# EAGLE design solar-fan (EAGLE 7.4.0)
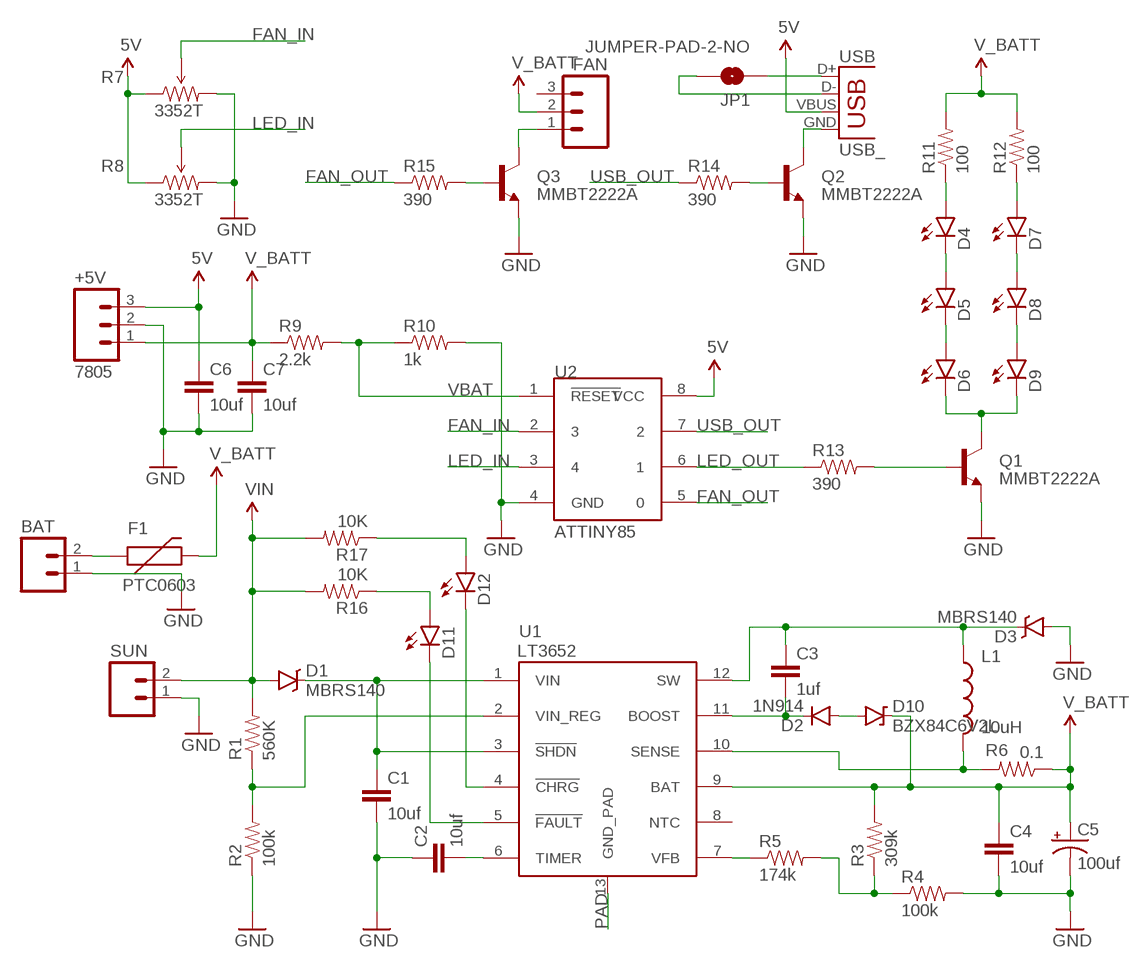
[diagram p0: schematic, sheet 1]

## Parts
+5V  7805  M03PTH  [1X03]
BAT  M025MM  [SCREWTERMINAL-5MM-2]
C1  10uf  CAP0603-CAP  [0603-CAP]
C2  10uf  CAP0603-CAP  [0603-CAP]
C3  1uf  CAP0603-CAP  [0603-CAP]
C4  10uf  CAP0603-CAP  [0603-CAP]
C5  100uf  CAP_POLPTH1  [CPOL-RADIAL-100UF-25V]
C6  10uf  CAP0603-CAP  [0603-CAP]
C7  10uf  CAP0603-CAP  [0603-CAP]
D1  MBRS140  DIODE-SCHOTTKY-MBRA140  [SMA-DIODE]
D2  1N914  DIODEBAS16  [SOD-323]
D3  MBRS140  DIODE-SCHOTTKY-MBRA140  [SMA-DIODE]
D4  LED-WHITE0603  [LED-0603]
D5  LED-WHITE0603  [LED-0603]
D6  LED-WHITE0603  [LED-0603]
D7  LED-WHITE0603  [LED-0603]
D8  LED-WHITE0603  [LED-0603]
D9  LED-WHITE0603  [LED-0603]
D10  BZX84C6V2L  [SOT23-3]
D11  LED-WHITE0603  [LED-0603]
D12  LED-WHITE0603  [LED-0603]
F1  PTC0603  [0603]
FAN  M03POLAR  [MOLEX-1X3]
JP1  JUMPER-PAD-2-NO  [PAD-JUMPER-2-NO_NO_SILK]
L1  10uH  INDUCTORRLB0912  [RLB0912]
Q1  MMBT2222A  TRANSISTOR_NPNMMBT2222A  [SOT23-3]
Q2  MMBT2222A  TRANSISTOR_NPNMMBT2222A  [SOT23-3]
Q3  MMBT2222A  TRANSISTOR_NPNMMBT2222A  [SOT23-3]
R1  560K  RESISTOR0603-RES  [0603-RES]
R2  100k  RESISTOR0603-RES  [0603-RES]
R3  309k  RESISTOR0603-RES  [0603-RES]
R4  100k  RESISTOR0603-RES  [0603-RES]
R5  174k  RESISTOR0603-RES  [0603-RES]
R6  0.1  RESISTOR0603-RES  [0603-RES]
R7  3352T  [3352T]
R8  3352T  [3352T]
R9  2.2k  RESISTOR0603-RES  [0603-RES]
R10  1k  RESISTOR0603-RES  [0603-RES]
R11  100  RESISTOR0603-RES  [0603-RES]
R12  100  RESISTOR0603-RES  [0603-RES]
R13  390  RESISTOR0603-RES  [0603-RES]
R14  390  RESISTOR0603-RES  [0603-RES]
R15  390  RESISTOR0603-RES  [0603-RES]
R16  10K  RESISTOR0603-RES  [0603-RES]
R17  10K  RESISTOR0603-RES  [0603-RES]
SUN  M025MM  [SCREWTERMINAL-5MM-2]
U1  LT3652  [MSOP-12_GND]
U2  ATTINY85  [8P3]
USB  USB_  [USB-A-S-SILK-FEMALE]

## Nets
5V: +5V.3 C6.1 R7.CCW R8.CCW U2.8(VCC) USB.VBUS
BOOST: C3.2 D2.C U1.11(BOOST)
FAN_IN: R7.WIPER U2.2
FAN_OUT: R15.1 U2.5
GND: +5V.2 BAT.1 C1.2 C2.1 C4.2 C5.2(-) C6.2 C7.2 D3.A Q1.2(E) Q2.2(E) Q3.2(E) R2.1 R4.2 R7.CW R8.CW R10.2 SUN.1 U2.4(GND)
LED_IN: R8.WIPER U2.3
LED_OUT: R13.1 U2.6
N$1: Q1.1(B) R13.2
N$2: Q2.1(B) R14.2
N$3: Q3.1(B) R15.2
N$6: FAN.1 Q3.3(C)
N$7: R3.1 R4.1 R5.2
N$8: JP1.1 USB.D+
N$9: JP1.2 USB.D-
N$10: D2.A D10.1(A)
N$11: D12.A R17.1
N$12: D12.C U1.4(!CHRG)
N$13: D4.A R11.1
N$14: D7.A R12.1
N$15: D4.C D5.A
N$16: D7.C D8.A
N$17: D5.C D6.A
N$18: D8.C D9.A
N$19: D6.C D9.C Q1.3(C)
N$20: D11.C U1.5(!FAULT)
N$21: Q2.3(C) USB.GND
N$22: D11.A R16.1
N$23: BAT.2 F1.1
PAD: U1.13(GND_PAD)
SENSE: L1.2 R6.2 U1.10(SENSE)
SHDN: C1.1 D1.C U1.1(VIN) U1.3(!SHDN)
SW: C3.1 D3.C L1.1 U1.12(SW)
TIMER: C2.2 U1.6(TIMER)
USB_OUT: R14.1 U2.7
V_BATT: +5V.1 C4.1 C5.1(+) C7.1 D10.3(C) F1.2 FAN.2 R3.2 R6.1 R9.1 R11.2 R12.2 U1.9(BAT)
VBAT: R9.2 R10.1 U2.1(!RESET)
VFB: R5.1 U1.7(VFB)
VIN: D1.A R1.2 R16.2 R17.2 SUN.2
VIN_REG: R1.1 R2.2 U1.2(VIN_REG)
Unconnected: FAN.3 U1.8(NTC)

## Library data of the parts
+5V = SparkFun-Connectors:M03: Header 3 Standard 3-pin 0.1" header. Use with straight break away headers (SKU : PRT-00116), right angle break away headers (PRT-00553), swiss pins (PRT-00743), machine pins (PRT-00117), and female headers (PRT-00115). Molex polarized connector foot print use with SKU : PRT-08232 with associated crimp pins and housings.; PN: 811-2196-5-ND; PN2: LM7805CT-ND
BAT SUN = SparkFun-Connectors:M02: Standard 2-pin 0.1" header. Use with - straight break away headers ( PRT-00116) - right angle break away headers (PRT-00553) - swiss pins (PRT-00743) - machine pins (PRT-00117) - female headers (PRT-00115) Molex polarized connector foot print use with: PRT-08233 with associated crimp pins and housings. 2.54_SCREWTERM for use with PRT-10571. 3.5mm Screw Terminal footprints for PRT-08084 5mm Screw Terminal footprints for use with PRT-08432; PN: 277-1667-ND; STOREFRONT_ID: PRT-08432
C1 C2 C4 C6 C7 = SparkFun-Passives:CAP: Capacitor Standard 0603 ceramic capacitor, and 0.1" leaded capacitor.; PN: 490-7202-1-ND
C3 = SparkFun-Passives:CAP: Capacitor Standard 0603 ceramic capacitor, and 0.1" leaded capacitor.; PN: 490-1536-1-ND
C5 = SparkFun-Passives:CAP_POL: Capacitor Polarized These are standard SMD and PTH capacitors. Normally 10uF, 47uF, and 100uF in electrolytic and tantalum varieties. Always verify the external diameter of the through hole cap, it varies with capacity, voltage, and manufacturer. The EIA devices should be standard.; PN: 399-6650-1-ND
D1 D3 = SparkFun-DiscreteSemi:DIODE-SCHOTTKY: Schottky diodes in SFE's production catalog BAT20J 1A 23V 0.62Vf RB751 120mA 40V 0.37Vf PMEG4005EJ 0.5A 40V 0.42Vf MBRA140 1A 40V 0.5Vf B340A 3A 40V SMA; PN: MBRS140T3GOSCT-ND; PROD_ID: DIO-08053; VALUE: MBRA140
D2 = SparkFun-DiscreteSemi:DIODE: Diode These are standard reverse protection diodes and small signal diodes. SMA package can handle up to about 1A. SOD-323 can handle about 200mA. What the SOD-323 package when ordering, there are some mfgs out there that are 5-pin packages.; PN: 1N914BWSCT-ND; PROD_ID: DIO-09646; VALUE: 250mA/100V
D4-D9 = SparkFun-LED:LED-WHITE: White SMD LEDs LilyPad 1206- DIO-09955; PN: 1516-1057-1-ND; PROD_ID: DIO-09004
D10 = SparkFun-DiscreteSemi:BZX84C6V2L; PN: SZBZX84C6V2LT1GOSCT-ND
D11 = SparkFun-LED:LED-WHITE: White SMD LEDs LilyPad 1206- DIO-09955; PN: 160-1436-1-ND; PROD_ID: DIO-09004
D12 = SparkFun-LED:LED-WHITE: White SMD LEDs LilyPad 1206- DIO-09955; PN: 160-1437-1-ND; PROD_ID: DIO-09004
F1 = SparkFun-PowerIC:PTC: Resettable Fuse PTC Resettable Fuse. Spark Fun Electronics SKU : COM-08357; PN: SF-0603S200-2CT-ND
FAN = SparkFun-Connectors:M03: Header 3 Standard 3-pin 0.1" header. Use with straight break away headers (SKU : PRT-00116), right angle break away headers (PRT-00553), swiss pins (PRT-00743), machine pins (PRT-00117), and female headers (PRT-00115). Molex polarized connector foot print use with SKU : PRT-08232 with associated crimp pins and housings.; PN: WM4201-ND
JP1 = SparkFun-Passives:JUMPER-PAD-2-NO
L1 = SparkFun-Passives:INDUCTOR: Inductors Basic Inductor/Choke - 0603 and 1206. Footprints are not proven and vary greatly between part numbers. INDUCTOR POWER 3.3UH 4.0A SMD 0.197" L x 0.197" W x 0.177" H (5.00mm x 5.00mm x 4.50mm); PN: RLB0912-100KL-ND
Q1-Q3 = SparkFun-DiscreteSemi:TRANSISTOR_NPN: Generic NPN BJT MMBT2222A - TRANS-08049 (SOT-23, 1A 40V) MPSA42 - TRANS-09116 (SOT-23, 500mA 300V) MMBT5088LT1G - TRANS-11160 (SOT-23, 50 mA 30V) BC547 - COM-08928 <http://www.sparkfun.com/products/8928> (TO-92 45V 100mA) (1.Collector 2.Base 3.Emitter) 2N3904 - COM-00521 <http://www.sparkfun.com/products/521> (TO-92 40V 200mA) (1.Emitter 2.Base 3.Collector) P2N2222A - COM-12852 <http://www.sparkfun.com/products/12852> (TO-92 40V 600mA) (1.Collector 2.Base 3.Emitter); PN: MMBT2222AFSCT-ND; PROD_ID: TRANS-08049
R1 = SparkFun-Passives:RESISTOR: Resistor Basic schematic elements and footprints for 0603, 1206, and PTH resistors.; PN: P560KGCT-ND
R2 R4 = SparkFun-Passives:RESISTOR: Resistor Basic schematic elements and footprints for 0603, 1206, and PTH resistors.; PN: P100KHCT-ND
R3 = SparkFun-Passives:RESISTOR: Resistor Basic schematic elements and footprints for 0603, 1206, and PTH resistors.; PN: P309KHCT-ND
R5 = SparkFun-Passives:RESISTOR: Resistor Basic schematic elements and footprints for 0603, 1206, and PTH resistors.; PN: P174KHCT-ND
R6 = SparkFun-Passives:RESISTOR: Resistor Basic schematic elements and footprints for 0603, 1206, and PTH resistors.; PN: 1276-6155-1-ND
R7 R8 = bourns3352:3352T; PN: 3352T-103LF-ND
R9 = SparkFun-Passives:RESISTOR: Resistor Basic schematic elements and footprints for 0603, 1206, and PTH resistors.; PN: P2.20KHCT-ND
R10 = SparkFun-Passives:RESISTOR: Resistor Basic schematic elements and footprints for 0603, 1206, and PTH resistors.; PN: P1.00KHCT-ND
R11 R12 = SparkFun-Passives:RESISTOR: Resistor Basic schematic elements and footprints for 0603, 1206, and PTH resistors.; PN: P100HCT-ND
R13-R15 = SparkFun-Passives:RESISTOR: Resistor Basic schematic elements and footprints for 0603, 1206, and PTH resistors.; PN: P390HCT-ND
R16 R17 = SparkFun-Passives:RESISTOR: Resistor Basic schematic elements and footprints for 0603, 1206, and PTH resistors.; PN: P10KGCT-ND
U1 = SparkFun-PowerIC:LT3652: LT3652 MPPT Solar Charge Controller 5V-32V smart charger for batteries up to 14.4V; PN: LT3652EMSE#PBF-ND
U2 = attiny85:ATTINY85; PN: ATTINY85-20PU-ND; PN2: AE9986-ND
USB = SparkFun-Connectors:USB: USB Connectors USB-B-PTH is fully proven SKU : PRT-00139/CONN-08278 USB-miniB is fully proven SKU : PRT-00587 USB-A-PCB is untested. USB-A-H is throughly reviewed, but untested. Spark Fun Electronics SKU : PRT-00437 USB-B-SMT is throughly reviewed, but untested. Needs silkscreen touching up. USB-A-S has not been used/tested USB-MB-H has not been used/tested USB-MICROB has been used. CONN-09505; PN: 1175-1001-ND

## Board
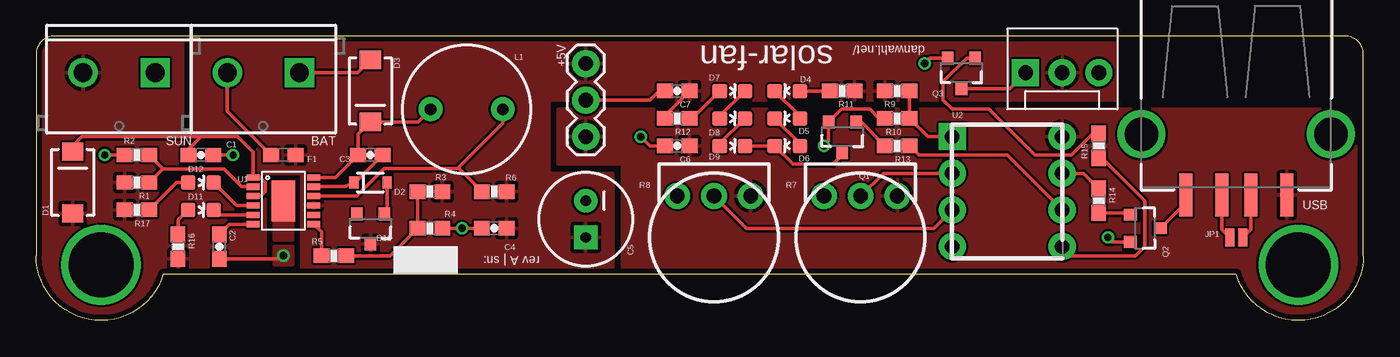
[diagram p1: board, top side]
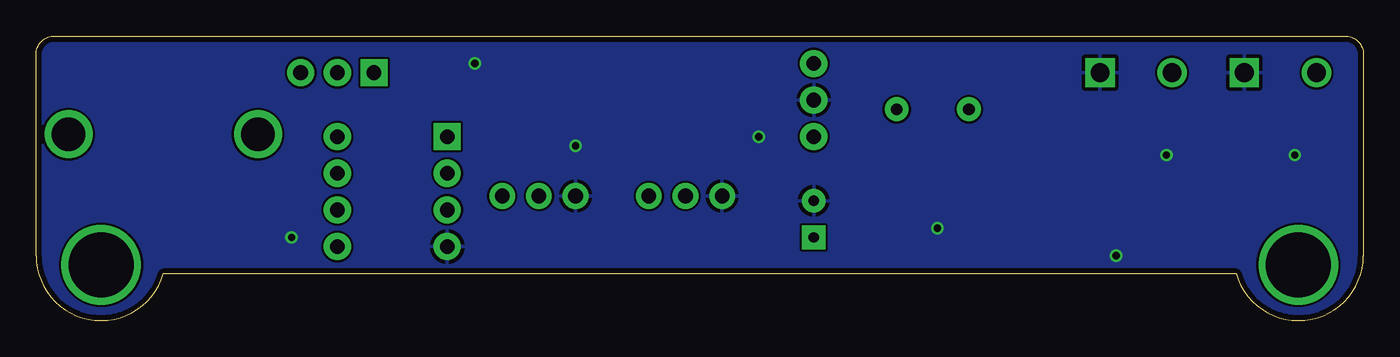
[diagram p2: board, bottom side, seen from below]

Size 92 x 19.74 mm. Coordinates in mm from the lower left corner, seen from the top.
Outline: 0,18.47 0,4.5 arc164 8.82,3.23 83.18,3.23 arc164 92,4.5 92,18.47 arc90 90.73,19.74 1.27,19.74 arc90 0,18.47
Copper layers (1*16): Top 0.0356mm / dielectric 1.5011mm / Bottom 0.0356mm
Design rules "LaenPCBOrder": minimum track width 6mil, minimum drill 13mil, track to track 6mil, track to pad 6mil, pad to pad 6mil, via to via 6mil, smd to smd 6mil, copper to edge 15mil, drill to drill 6mil, minimum pad ring 7mil, minimum via ring 7mil, stop-mask expansion 3mil, vias tented up to drill 0mil, thermal gap 10mil

### Footprints (pad centres in the part's own frame; a part is rotated, then mirrored left to right if it is on the bottom)
1X03 = drill 1.016 pad 1.88: 1 0,0; 2 2.54,0; 3 5.08,0
SCREWTERMINAL-5MM-2 = drill 1.3 pad 2.032 square: 1 0,0 | drill 1.3 pad 2.032: 2 5,0
0603-CAP = smd 1.1 x 1: 1 -0.85,0; 2 0.85,0
CPOL-RADIAL-100UF-25V = drill 0.7 pad 1.651 square: 1 1.27,0 | drill 0.7 pad 1.651: 2 -1.27,0
SMA-DIODE = smd 1.27 x 1.47: A -2.15,0; C 2.15,0
SOD-323 = smd 0.63 x 0.83: A 1.15,0; C -1.15,0
LED-0603 = smd 1 x 1: A 0,-0.877; C 0,0.877
SOT23-3 = smd 0.8 x 0.9: 1 -0.95,-1; 2 0.95,-1; 3 0,1.1
0603 = smd 1.1 x 1: 1 -0.85,0; 2 0.85,0
MOLEX-1X3 = drill 1.016 pad 1.88 square: 1 0,0 | drill 1.016 pad 1.88: 2 2.54,0; 3 5.08,0
PAD-JUMPER-2-NO_NO_SILK = smd 0.635 x 1.27: 1 -0.45,0; 2 0.45,0
RLB0912 = drill 0.813 pad 1.651: 1 2.502,0; 2 -2.502,0
0603-RES = smd 1.1 x 1: 1 -0.85,0; 2 0.85,0
3352T = drill 1.016 pad 1.778: CCW -2.54,-2.87; CW 2.54,-2.87; WIPER 0,-2.87
MSOP-12_GND = smd 0.889 x 0.42: 1 -2.1,1.625; 2 -2.1,0.975; 3 -2.1,0.325; 4 -2.1,-0.325; 5 -2.1,-0.975; 6 -2.1,-1.625; 7 2.1,-1.625; 8 2.1,-0.975; 9 2.1,-0.325; 10 2.1,0.325; 11 2.1,0.975; 12 2.1,1.625 | smd 1.651 x 2.845: 13 0,0
8P3 = drill 1.016 pad 1.88 square: 1 -3.81,3.81 | drill 1.016 pad 1.88: 2 -3.81,1.27; 3 -3.81,-1.27; 4 -3.81,-3.81; 5 3.81,-3.81; 6 3.81,-1.27; 7 3.81,1.27; 8 3.81,3.81
USB-A-S-SILK-FEMALE = smd 3 x 0.9: D+ 7.212,-1; D- 7.212,1; GND 7.212,-3.5; VBUS 7.212,3.5 | drill 2.311: P$5 3,-6.566; P$6 3,6.566

### Placement (x,y rotation side)
+5V  38.1,17.83 270 top
BAT  18.25,17.2 180 top
C1  11.43,11.48 0 top
C2  12.7,5.13 90 top
C3  23.18,11.48 0 top
C4  31.75,6.4 180 top
C5  38.1,7.04 270 top
C6  44.45,12.12 180 top
C7  44.45,15.93 180 top
D1  2.54,9.58 90 top
D2  23.18,9.58 0 top
D3  23.18,15.93 270 top
D4  52.07,15.93 90 top
D5  52.07,14.02 90 top
D6  52.07,12.12 90 top
D7  48.26,15.93 270 top
D8  48.26,14.02 270 top
D9  48.26,12.12 270 top
D10  23.18,6.4 180 top
D11  11.43,7.67 270 top
D12  11.43,9.58 270 top
F1  17.14,11.48 0 top
FAN  68.58,17.2 0 top
JP1  83.19,5.77 0 top
L1  29.84,14.66 180 top
Q1  55.88,12.75 180 top
Q2  76.83,6.4 270 top
Q3  64.14,17.2 180 top
R1  6.99,9.58 180 top
R2  6.99,11.48 0 top
R3  27.3,8.94 0 top
R4  27.3,6.4 0 top
R5  20.64,4.5 0 top
R6  31.75,8.94 180 top
R7  57.15,5.77 180 top
R8  46.99,5.77 180 top
R9  59.69,15.93 0 top
R10  59.69,14.02 180 top
R11  55.88,15.93 0 top
R12  44.45,14.02 180 top
R13  59.69,12.12 180 top
R14  73.66,8.31 270 top
R15  73.66,12.12 90 top
R16  9.84,5.13 270 top
R17  6.99,7.67 180 top
SUN  8.26,17.2 180 top
U1  17.14,8.31 0 top
U2  67.31,8.94 0 top
USB  83.19,15.93 270 top

### Tracks (layer width: path | path; a pad name or v marks a point on that pad's centre or on a via)
5V
  pour Top: 36.2,14.66 94.61,14.66 94.61,-1.85 40.64,-1.85 40.64,10.85 36.2,10.85
BOOST
  Top 0.254: U1.11 21.41,9.28 D2.C 22.12,9.58 C3.2
FAN_IN
  Top 0.254: R7.WIPER 58.73,10.21 U2.2
FAN_OUT
  Top 0.254: R15.1 73.88,11.27 76.83,8.31 76.83,5.13 76.2,4.5 71.75,4.5 U2.5
GND  (via drill 0.5)
  Top 0.254: Q2.2 74.61,5.45 v74.3,5.77 | C6.2 42.55,12.12 v41.91,12.75 | v54.61,12.12 54.93,12.44 Q1.2 55.84,14.66 57.78,14.66 58.42,14.02 R10.2 | Q3.2 61.96,18.2 v61.59,17.83 | 6.13,11.69 R2.1 v4.76,11.48 | C1.2 v13.65,11.48 | R4.2 v29.53,6.4 C4.2 | D3.A 22.3,17.2 BAT.1 | C7.2 43.18,15.93 42.55,15.29 +5V.2 | C2.1 16.93,4.28 v17.14,4.5
  pour Bottom: -0.64,21.01 93.98,21.01 93.98,-1.22 -0.64,-1.22
  pour Top: 16.51,5.13 17.78,5.13 17.78,3.86 16.51,3.86
LED_IN
  Top 0.254: U2.3 62.23,6.4 49.23,6.4 R8.WIPER
LED_OUT
  Top 0.254: U2.6 67.31,11.48 61.17,11.48 R13.1
N$1
  Top 0.254: Q1.1 57.2,13.75 R13.2
N$2
  Top 0.254: R14.2 75.73,7.46 Q2.1
N$3
  Top 0.254: 65.14,18.2 Q3.1 64.5,18.2 62.87,16.56 62.87,15.29 63.5,14.66 66.04,14.66 69.22,11.48 71.75,11.48 73.24,12.97 R15.2
N$4  (via drill 4.5)
  other vias: 87.5,3.86
N$5  (via drill 4.5)
  other vias: 4.5,3.86
N$6
  Top 0.254: Q3.3 67.48,16.1 FAN.1
N$7
  Top 0.254: R3.1 R4.1 24.55,4.5 R5.2
N$8
  Top 0.254: JP1.1 82.19,6.32 USB.D+
N$9
  Top 0.254: JP1.2 84.19,6.32 USB.D-
N$10
  Top 0.254: 24.01,7.6 D10.1 24.33,7.6 D2.A
N$11
  Top 0.254: D12.A 9.74,9.58 R17.1
N$12
  Top 0.254: 12.63,9.25 D12.C 13.9,7.98 U1.4
N$13
  Top 0.254: D4.A R11.1
N$14
  Top 0.254: R12.1 45.48,14.02 D7.A
N$15
  Top 0.254: D5.A 52.95,14.18 D4.C
N$16
  Top 0.254: D8.A 47.38,14.18 D7.C
N$17
  Top 0.254: D6.A 52.95,12.27 D5.C
N$18
  Top 0.254: D9.A 47.38,12.27 D8.C
N$19
  Top 0.254: D9.C D6.C 52.46,10.85 55.24,10.85 55.88,11.48 Q1.3
N$20
  Top 0.254: 12.6,7.97 D11.C 12.65,7.33 U1.5
N$21
  Top 0.254: USB.GND 79.69,8.15 Q2.3
N$22
  Top 0.254: 10.58,7.65 D11.A 9.84,6.96 R16.1
N$23
  Top 0.254: BAT.2 13.26,14.52 F1.1
PAD
  pour Top: 16.51,8.94 16.51,5.58 17.78,5.58 17.78,8.94
SENSE
  Top 0.254: R6.2 29.31,10.53 29.21,10.53 | L1.2 32.35,13.67 29.37,10.69 29.21,10.53 | U1.10 22.23,8.63 24.13,10.53 29.21,10.53
SHDN
  Top 0.254: D1.C 2.54,12.12 3.17,12.75 11.43,12.75 | C1.1 10.58,11.9 11.43,12.75 | U1.3 15.56,8.63 15.88,8.94 15.88,9.58 15.52,9.93 U1.1 15.04,11.68 13.97,12.75 11.43,12.75
SW
  Top 0.254: L1.1 26.46,13.78 D3.C 22.33,12.93 C3.1 20.78,9.93 U1.12
TIMER
  Top 0.254: U1.6 13.4,6.68 C2.2
USB_OUT
  Top 0.254: U2.7 72.61,10.21 R14.1
V_BATT
  Top 0.254: R12.2 43.6,14.23 C7.1
  pour Top: 10.79,21.64 10.79,10.21 18.41,10.21 18.41,1.96 40.01,1.96 40.01,10.21 35.56,10.21 35.56,15.29 74.93,15.29 74.93,21.64
VBAT
  Top 0.254: U2.1 61.81,12.75 R10.1 R9.2
VFB
  Top 0.254: R5.1 19.79,6.14 U1.7
VIN
  pour Top: -1.27,21.01 10.16,21.01 10.16,9.58 15.88,9.58 15.88,-0.58 -1.27,-0.58
VIN_REG
  Top 0.254: 8.18,11.82 R2.2 8.77,10.55 8.77,10.51 | 8.77,10.51 R1.1 | 8.77,10.51 13.04,10.51 14.27,9.28 U1.2

### Text on the board
tPlace: solar-fan | danwahl.net/ | rev A | sn: